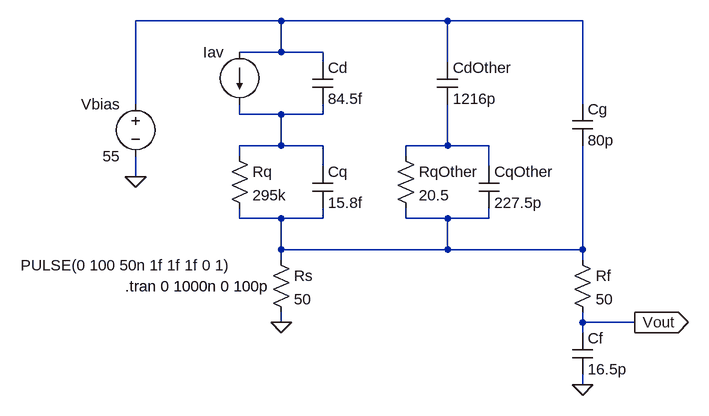
[diagram p0: schematic example.asc]
example.asc, the LTspice schematic file:
Version 4
SHEET 1 1180 680
WIRE 208 -224 -16 -224
WIRE 464 -224 208 -224
WIRE 672 -224 464 -224
WIRE 208 -176 208 -224
WIRE 208 -176 144 -176
WIRE 272 -176 208 -176
WIRE 272 -160 272 -176
WIRE 464 -160 464 -224
WIRE -16 -96 -16 -224
WIRE 672 -96 672 -224
WIRE 144 -80 144 -96
WIRE 208 -80 144 -80
WIRE 272 -80 272 -96
WIRE 272 -80 208 -80
WIRE 208 -32 208 -80
WIRE 208 -32 144 -32
WIRE 272 -32 208 -32
WIRE 464 -32 464 -96
WIRE 464 -32 400 -32
WIRE 528 -32 464 -32
WIRE 144 -16 144 -32
WIRE 400 -16 400 -32
WIRE 272 0 272 -32
WIRE 528 0 528 -32
WIRE -16 16 -16 -16
WIRE 144 80 144 64
WIRE 208 80 144 80
WIRE 272 80 272 64
WIRE 272 80 208 80
WIRE 400 80 400 64
WIRE 464 80 400 80
WIRE 528 80 528 64
WIRE 528 80 464 80
WIRE 208 128 208 80
WIRE 464 128 464 80
WIRE 464 128 208 128
WIRE 672 128 672 -32
WIRE 672 128 464 128
WIRE 208 144 208 128
WIRE 672 144 672 128
WIRE 208 240 208 224
WIRE 672 240 672 224
WIRE 752 240 672 240
WIRE 672 256 672 240
WIRE 672 336 672 320
FLAG -16 16 0
FLAG 672 336 0
FLAG 752 240 Vout
IOPIN 752 240 Out
FLAG 208 240 0
SYMBOL res 656 128 R0
SYMATTR InstName Rf
SYMATTR Value 50
SYMBOL res 128 -32 R0
SYMATTR InstName Rq
SYMATTR Value 295k
SYMBOL cap 256 0 R0
SYMATTR InstName Cq
SYMATTR Value 15.8f
SYMBOL res 384 -32 R0
SYMATTR InstName RqOther
SYMATTR Value 20.5
SYMBOL cap 512 0 R0
SYMATTR InstName CqOther
SYMATTR Value 227.5p
SYMBOL cap 656 -96 R0
SYMATTR InstName Cg
SYMATTR Value 80p
SYMBOL current 144 -176 M0
WINDOW 3 13 328 Left 2
WINDOW 123 0 0 Left 2
WINDOW 39 0 0 Left 2
SYMATTR Value PULSE(0 100 50n 1f 1f 1f 0 1)
SYMATTR InstName Iav
SYMBOL cap 256 -160 R0
SYMATTR InstName Cd
SYMATTR Value 84.5f
SYMBOL cap 448 -160 R0
SYMATTR InstName CdOther
SYMATTR Value 1216p
SYMBOL voltage -16 -112 M0
WINDOW 123 0 0 Left 2
WINDOW 39 0 0 Left 2
SYMATTR InstName Vbias
SYMATTR Value 55
SYMBOL cap 656 320 M180
WINDOW 0 24 56 Left 2
WINDOW 3 24 8 Left 2
SYMATTR InstName Cf
SYMATTR Value 16.5p
SYMBOL res 192 128 R0
SYMATTR InstName Rs
SYMATTR Value 50
TEXT -32 184 Left 2 !.tran 0 1000n 0 100p

The netlist it stands for:
* example.asc
Rf N004 Vout 50
Rq N002 N004 295k
Cq N002 N004 15.8f
RqOther N003 N004 20.5
CqOther N003 N004 227.5p
Cg N001 N004 80p
Iav N001 N002 PULSE(0 100 50n 1f 1f 1f 0 1)
Cd N001 N002 84.5f
CdOther N001 N003 1216p
Vbias N001 0 55
Cf 0 Vout 16.5p
Rs N004 0 50
.tran 0 1000n 0 100p
.backanno
.end